# EAGLE design RGBCUBEv1.0-led_board (EAGLE 5.11)
BOM: EXCLUDE; PARTNO: *
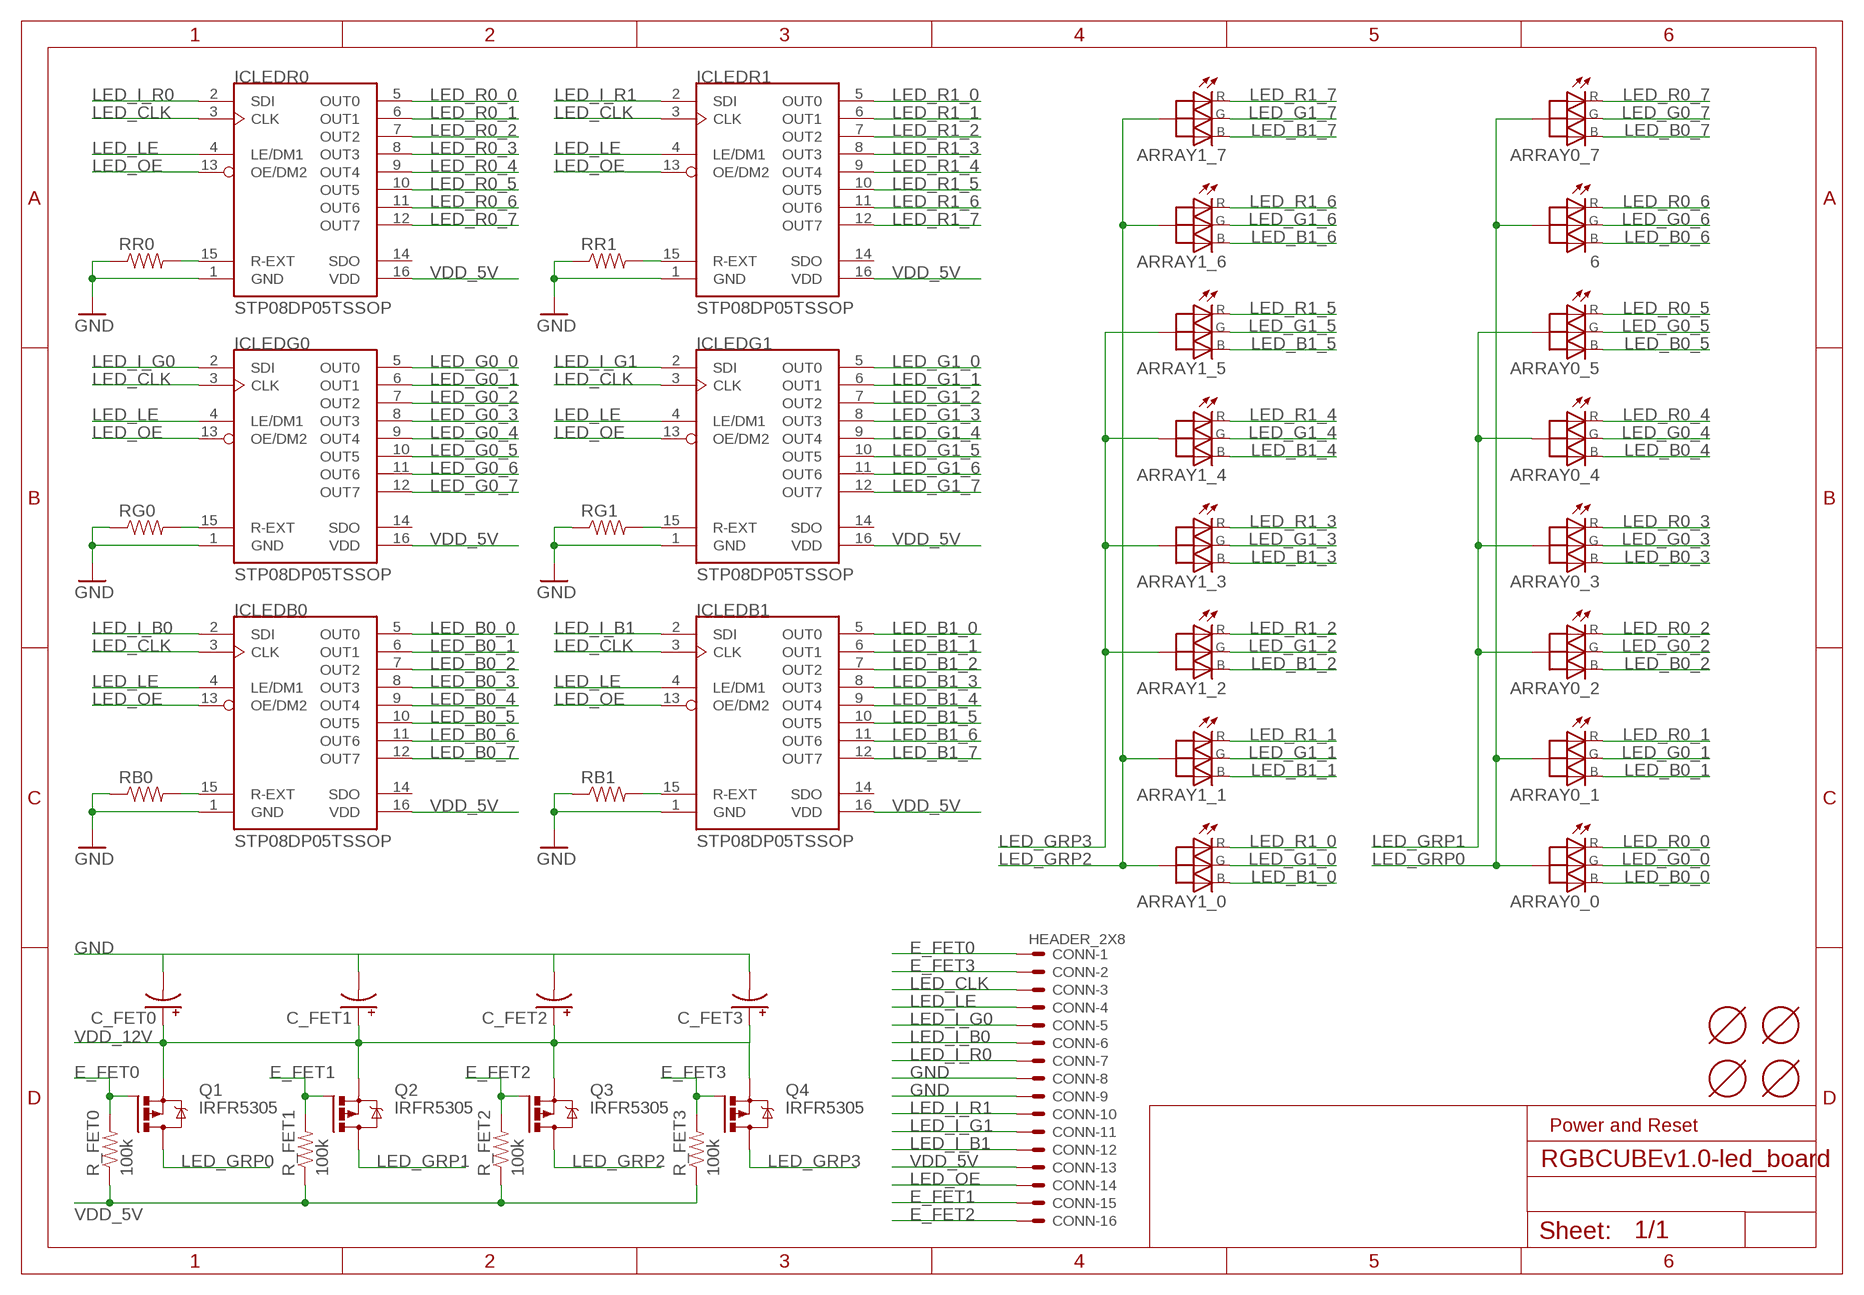
[diagram p0: schematic, sheet 1]

## Parts
6  LED_RGB_5MMRAD  [LED_RGB_5MM_RAD]
ARRAY0_0  LED_RGB_5MMRAD  [LED_RGB_5MM_RAD]
ARRAY0_1  LED_RGB_5MMRAD  [LED_RGB_5MM_RAD]
ARRAY0_2  LED_RGB_5MMRAD  [LED_RGB_5MM_RAD]
ARRAY0_3  LED_RGB_5MMRAD  [LED_RGB_5MM_RAD]
ARRAY0_4  LED_RGB_5MMRAD  [LED_RGB_5MM_RAD]
ARRAY0_5  LED_RGB_5MMRAD  [LED_RGB_5MM_RAD]
ARRAY0_7  LED_RGB_5MMRAD  [LED_RGB_5MM_RAD]
ARRAY1_0  LED_RGB_5MMRAD  [LED_RGB_5MM_RAD]
ARRAY1_1  LED_RGB_5MMRAD  [LED_RGB_5MM_RAD]
ARRAY1_2  LED_RGB_5MMRAD  [LED_RGB_5MM_RAD]
ARRAY1_3  LED_RGB_5MMRAD  [LED_RGB_5MM_RAD]
ARRAY1_4  LED_RGB_5MMRAD  [LED_RGB_5MM_RAD]
ARRAY1_5  LED_RGB_5MMRAD  [LED_RGB_5MM_RAD]
ARRAY1_6  LED_RGB_5MMRAD  [LED_RGB_5MM_RAD]
ARRAY1_7  LED_RGB_5MMRAD  [LED_RGB_5MM_RAD]
C_FET0  CAP_POL7343  [EIA7343]
C_FET1  CAP_POL7343  [EIA7343]
C_FET2  CAP_POL7343  [EIA7343]
C_FET3  CAP_POL7343  [EIA7343]
CONN  HEADER_2X8  [HEADER_2MM_2X8]
ICLEDB0  STP08DP05TSSOP  [TSSOP-16]
ICLEDB1  STP08DP05TSSOP  [TSSOP-16]
ICLEDG0  STP08DP05TSSOP  [TSSOP-16]
ICLEDG1  STP08DP05TSSOP  [TSSOP-16]
ICLEDR0  STP08DP05TSSOP  [TSSOP-16]
ICLEDR1  STP08DP05TSSOP  [TSSOP-16]
Q1  IRFR5305  [D-PAK_TO252AA]
Q2  IRFR5305  [D-PAK_TO252AA]
Q3  IRFR5305  [D-PAK_TO252AA]
Q4  IRFR5305  [D-PAK_TO252AA]
R_FET0  100k  RESISTOR0402-RES  [0402-RES]
R_FET1  100k  RESISTOR0402-RES  [0402-RES]
R_FET2  100k  RESISTOR0402-RES  [0402-RES]
R_FET3  100k  RESISTOR0402-RES  [0402-RES]
RB0  RESISTOR0402-RES  [0402-RES]
RB1  RESISTOR0402-RES  [0402-RES]
RG0  RESISTOR0402-RES  [0402-RES]
RG1  RESISTOR0402-RES  [0402-RES]
RR0  RESISTOR0402-RES  [0402-RES]
RR1  RESISTOR0402-RES  [0402-RES]
U$1  MOUNT-HOLE3.1MM  [MOUNT-HOLE3.1]
U$2  MOUNT-HOLE3.1MM  [MOUNT-HOLE3.1]
U$3  MOUNT-HOLE3.1MM  [MOUNT-HOLE3.1]
U$4  MOUNT-HOLE3.1MM  [MOUNT-HOLE3.1]

## Nets
E_FET0: CONN.1 Q1.1(G) R_FET0.2
E_FET1: CONN.15 Q2.1(G) R_FET1.2
E_FET2: CONN.16 Q3.1(G) R_FET2.2
E_FET3: CONN.2 Q4.1(G) R_FET3.2
GND [power]: C_FET0.C(-) C_FET1.C(-) C_FET2.C(-) C_FET3.C(-) CONN.8 CONN.9 ICLEDB0.1(GND) ICLEDB1.1(GND) ICLEDG0.1(GND) ICLEDG1.1(GND) ICLEDR0.1(GND) ICLEDR1.1(GND) RB0.1 RB1.1 RG0.1 RG1.1 RR0.1 RR1.1
LED_B0_0: ARRAY0_0.B ICLEDB0.5(OUT0)
LED_B0_1: ARRAY0_1.B ICLEDB0.6(OUT1)
LED_B0_2: ARRAY0_2.B ICLEDB0.7(OUT2)
LED_B0_3: ARRAY0_3.B ICLEDB0.8(OUT3)
LED_B0_4: ARRAY0_4.B ICLEDB0.9(OUT4)
LED_B0_5: ARRAY0_5.B ICLEDB0.10(OUT5)
LED_B0_6: 6.B ICLEDB0.11(OUT6)
LED_B0_7: ARRAY0_7.B ICLEDB0.12(OUT7)
LED_B1_0: ARRAY1_0.B ICLEDB1.5(OUT0)
LED_B1_1: ARRAY1_1.B ICLEDB1.6(OUT1)
LED_B1_2: ARRAY1_2.B ICLEDB1.7(OUT2)
LED_B1_3: ARRAY1_3.B ICLEDB1.8(OUT3)
LED_B1_4: ARRAY1_4.B ICLEDB1.9(OUT4)
LED_B1_5: ARRAY1_5.B ICLEDB1.10(OUT5)
LED_B1_6: ARRAY1_6.B ICLEDB1.11(OUT6)
LED_B1_7: ARRAY1_7.B ICLEDB1.12(OUT7)
LED_CLK: CONN.3 ICLEDB0.3(CLK) ICLEDB1.3(CLK) ICLEDG0.3(CLK) ICLEDG1.3(CLK) ICLEDR0.3(CLK) ICLEDR1.3(CLK)
LED_G0_0: ARRAY0_0.G ICLEDG0.5(OUT0)
LED_G0_1: ARRAY0_1.G ICLEDG0.6(OUT1)
LED_G0_2: ARRAY0_2.G ICLEDG0.7(OUT2)
LED_G0_3: ARRAY0_3.G ICLEDG0.8(OUT3)
LED_G0_4: ARRAY0_4.G ICLEDG0.9(OUT4)
LED_G0_5: ARRAY0_5.G ICLEDG0.10(OUT5)
LED_G0_6: 6.G ICLEDG0.11(OUT6)
LED_G0_7: ARRAY0_7.G ICLEDG0.12(OUT7)
LED_G1_0: ARRAY1_0.G ICLEDG1.5(OUT0)
LED_G1_1: ARRAY1_1.G ICLEDG1.6(OUT1)
LED_G1_2: ARRAY1_2.G ICLEDG1.7(OUT2)
LED_G1_3: ARRAY1_3.G ICLEDG1.8(OUT3)
LED_G1_4: ARRAY1_4.G ICLEDG1.9(OUT4)
LED_G1_5: ARRAY1_5.G ICLEDG1.10(OUT5)
LED_G1_6: ARRAY1_6.G ICLEDG1.11(OUT6)
LED_G1_7: ARRAY1_7.G ICLEDG1.12(OUT7)
LED_GRP0: 6.A ARRAY0_0.A ARRAY0_1.A ARRAY0_7.A Q1.4(D)
LED_GRP1: ARRAY0_2.A ARRAY0_3.A ARRAY0_4.A ARRAY0_5.A Q2.4(D)
LED_GRP2: ARRAY1_0.A ARRAY1_1.A ARRAY1_6.A ARRAY1_7.A Q3.4(D)
LED_GRP3: ARRAY1_2.A ARRAY1_3.A ARRAY1_4.A ARRAY1_5.A Q4.4(D)
LED_I_B0: CONN.6 ICLEDB0.2(SDI)
LED_I_B1: CONN.12 ICLEDB1.2(SDI)
LED_I_G0: CONN.5 ICLEDG0.2(SDI)
LED_I_G1: CONN.11 ICLEDG1.2(SDI)
LED_I_R0: CONN.7 ICLEDR0.2(SDI)
LED_I_R1: CONN.10 ICLEDR1.2(SDI)
LED_LE: CONN.4 ICLEDB0.4(LE/DM1) ICLEDB1.4(LE/DM1) ICLEDG0.4(LE/DM1) ICLEDG1.4(LE/DM1) ICLEDR0.4(LE/DM1) ICLEDR1.4(LE/DM1)
LED_OE: CONN.14 ICLEDB0.13(OE/DM2) ICLEDB1.13(OE/DM2) ICLEDG0.13(OE/DM2) ICLEDG1.13(OE/DM2) ICLEDR0.13(OE/DM2) ICLEDR1.13(OE/DM2)
LED_R0_0: ARRAY0_0.R ICLEDR0.5(OUT0)
LED_R0_1: ARRAY0_1.R ICLEDR0.6(OUT1)
LED_R0_2: ARRAY0_2.R ICLEDR0.7(OUT2)
LED_R0_3: ARRAY0_3.R ICLEDR0.8(OUT3)
LED_R0_4: ARRAY0_4.R ICLEDR0.9(OUT4)
LED_R0_5: ARRAY0_5.R ICLEDR0.10(OUT5)
LED_R0_6: 6.R ICLEDR0.11(OUT6)
LED_R0_7: ARRAY0_7.R ICLEDR0.12(OUT7)
LED_R1_0: ARRAY1_0.R ICLEDR1.5(OUT0)
LED_R1_1: ARRAY1_1.R ICLEDR1.6(OUT1)
LED_R1_2: ARRAY1_2.R ICLEDR1.7(OUT2)
LED_R1_3: ARRAY1_3.R ICLEDR1.8(OUT3)
LED_R1_4: ARRAY1_4.R ICLEDR1.9(OUT4)
LED_R1_5: ARRAY1_5.R ICLEDR1.10(OUT5)
LED_R1_6: ARRAY1_6.R ICLEDR1.11(OUT6)
LED_R1_7: ARRAY1_7.R ICLEDR1.12(OUT7)
RB0: ICLEDB0.15(R-EXT) RB0.2
RB1: ICLEDB1.15(R-EXT) RB1.2
RG0: ICLEDG0.15(R-EXT) RG0.2
RG1: ICLEDG1.15(R-EXT) RG1.2
RR0 [power]: ICLEDR0.15(R-EXT) RR0.2
RR1 [power]: ICLEDR1.15(R-EXT) RR1.2
VDD_5V [power]: CONN.13 ICLEDB0.16(VDD) ICLEDB1.16(VDD) ICLEDG0.16(VDD) ICLEDG1.16(VDD) ICLEDR0.16(VDD) ICLEDR1.16(VDD) R_FET0.1 R_FET1.1 R_FET2.1 R_FET3.1
VDD_12V: C_FET0.A(+) C_FET1.A(+) C_FET2.A(+) C_FET3.A(+) Q1.3(S) Q2.3(S) Q3.3(S) Q4.3(S)
Unconnected: ICLEDB0.14(SDO) ICLEDB1.14(SDO) ICLEDG0.14(SDO) ICLEDG1.14(SDO) ICLEDR0.14(SDO) ICLEDR1.14(SDO)

## Notes on the sheet
- Power and Reset

## Library data of the parts
6 ARRAY0_0 ARRAY0_1-ARRAY0_5 ARRAY0_7 ARRAY1_0 ARRAY1_1-ARRAY1_7 = rgb_cube:LED_RGB_5MM
C_FET0 C_FET1-C_FET3 = rgb_cube:CAP_POL: Capacitor Polarized These are standard SMD and PTH capacitors. Normally 10uF, 47uF, and 100uF in electrolytic and tantalum varieties. Always verify the external diameter of the through hole cap, it varies with capacity, voltage, and manufacturer. The EIA devices should be standard.
CONN = rgb_cube:HEADER_2X8
ICLEDB0 ICLEDB1 ICLEDG0 ICLEDG1 ICLEDR0 ICLEDR1 = rgb_cube:STP08DP05
Q1-Q4 = transistor-power:IRF?5305: HEXFET Power MOSFET Source: http://www.irf.com/product-info/datasheets/data/irfr5305pbf.pdf
R_FET0 R_FET1-R_FET3 RB0 RB1 RG0 RG1 RR0 RR1 = rgb_cube:RESISTOR: Resistor Basic schematic elements and footprints for 0603, 1206, and PTH 1/10th watt (small) resistors.
U$1-U$4 = pixhawk2:MOUNT-HOLE

## Net classes
0 signal: width 0.203 mm, drill 0.3 mm, clearance 0.203 mm
1 power: width 0.254 mm, drill 0.3 mm, clearance 0.203 mm

## Board
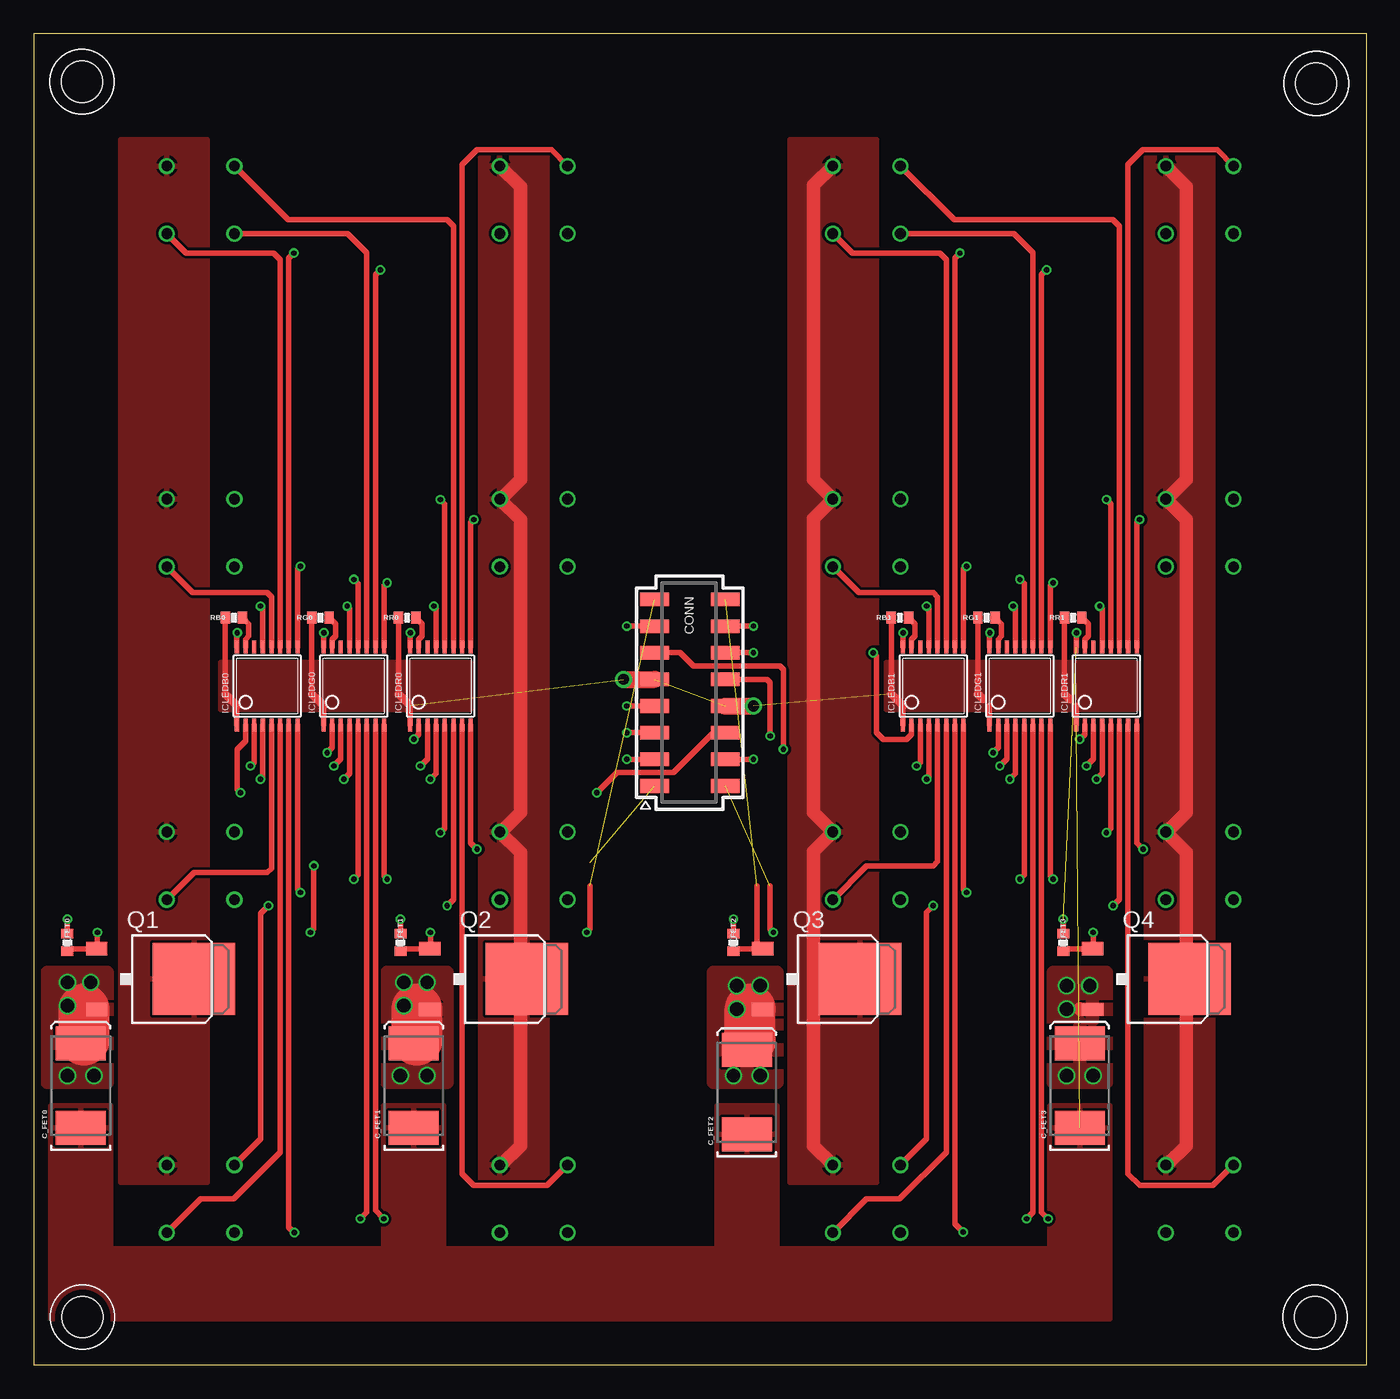
[diagram p1: board, top side]
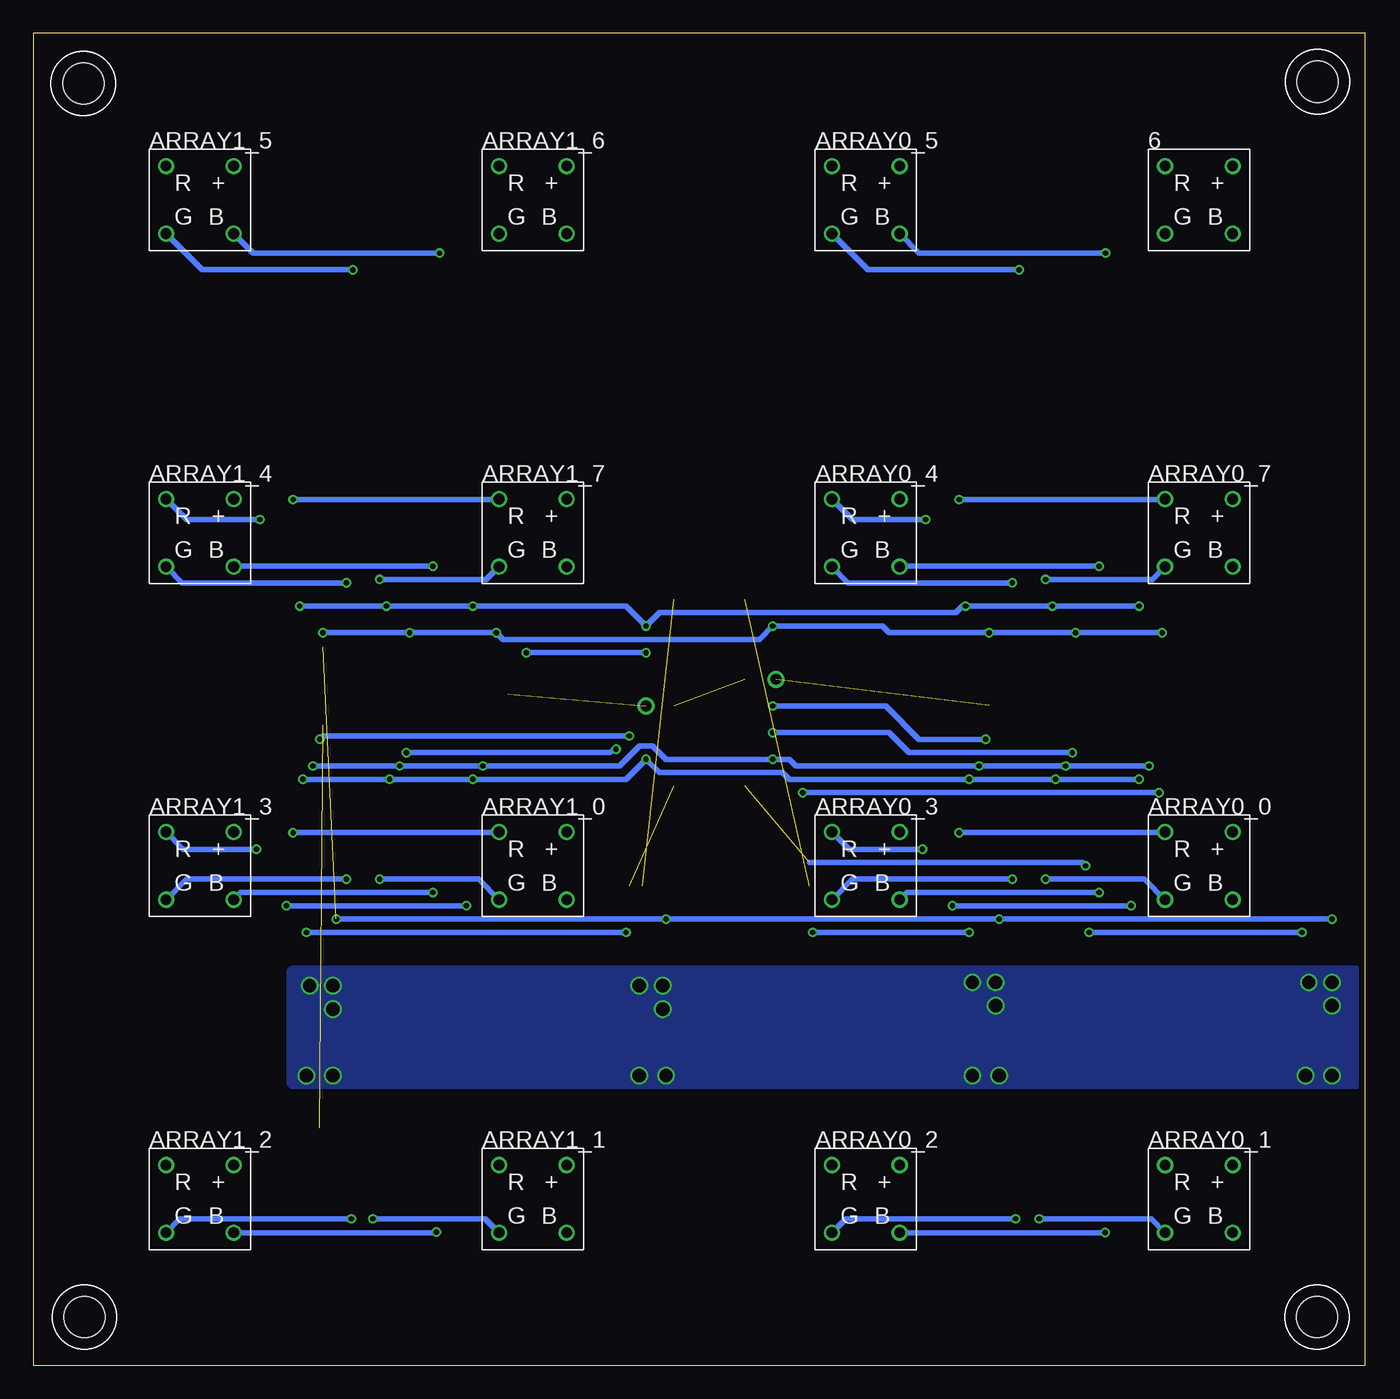
[diagram p2: board, bottom side, seen from below]

Size 100 x 100 mm. Coordinates in mm from the lower left corner, seen from the top.
Outline: 0,0 0,100 100,100 100,0 0,0
Copper layers (1*16): Top 0.035mm / dielectric 1.5mm / Bottom 0.035mm
Design rules "multi-cb_035um-cu *": minimum track width 6mil, minimum drill 12mil, track to track 6mil, track to pad 6mil, pad to pad 6mil, via to via 6mil, smd to smd 6mil, copper to edge 20mil, drill to drill 8mil, minimum pad ring 8mil, minimum via ring 6mil, stop-mask expansion 3mil, vias tented up to drill 0mil, thermal gap 8mil

### Footprints (pad centres in the part's own frame; a part is rotated, then mirrored left to right if it is on the bottom)
LED_RGB_5MM_RAD = drill 0.8 round: A 2.54,2.54; B 2.54,-2.54; G -2.54,-2.54; R -2.54,2.54
EIA7343 = smd 2.55 x 3.75: A 3.17,0; C -3.17,0
HEADER_2MM_2X8 = smd 1.02 x 2.16: 1 7,-2.925; 2 7,2.385; 3 5,-2.925; 4 5,2.385; 5 3,-2.925; 6 3,2.385; 7 1,-2.925; 8 1,2.385; 9 -1,-2.925; 10 -1,2.385; 11 -3,-2.925; 12 -3,2.385; 13 -5,-2.925; 14 -5,2.385; 15 -7,-2.925; 16 -7,2.385
TSSOP-16 = smd 0.305 x 0.991: 1 -2.275,-2.918; 2 -1.625,-2.918; 3 -0.975,-2.918; 4 -0.325,-2.918; 5 0.325,-2.918; 6 0.975,-2.918; 7 1.625,-2.918; 8 2.275,-2.918; 9 2.275,2.918; 10 1.625,2.918; 11 0.975,2.918; 12 0.325,2.918; 13 -0.325,2.918; 14 -0.975,2.918; 15 -1.625,2.918; 16 -2.275,2.918
D-PAK_TO252AA = smd 1 x 1.6: 1 -2.28,-4.8; 3 2.28,-4.8 | smd 5.4 x 6.2: 4 0,2.5
0402-RES = smd 0.7 x 0.9: 1 -0.65,0; 2 0.65,0
MOUNT-HOLE3.1 = hole 3.1: 0,0

### Placement (x,y rotation side)
6  12.5,87.5 0 bottom
ARRAY0_0  12.5,37.5 0 bottom
ARRAY0_1  12.5,12.5 0 bottom
ARRAY0_2  37.5,12.5 0 bottom
ARRAY0_3  37.5,37.5 0 bottom
ARRAY0_4  37.5,62.5 0 bottom
ARRAY0_5  37.5,87.5 0 bottom
ARRAY0_7  12.5,62.5 0 bottom
ARRAY1_0  62.5,37.5 0 bottom
ARRAY1_1  62.5,12.5 0 bottom
ARRAY1_2  87.5,12.5 0 bottom
ARRAY1_3  87.5,37.5 0 bottom
ARRAY1_4  87.5,62.5 0 bottom
ARRAY1_5  87.5,87.5 0 bottom
ARRAY1_6  62.5,87.5 0 bottom
ARRAY1_7  62.5,62.5 0 bottom
C_FET0  3.5,21 90 top
C_FET1  28.5,21 90 top
C_FET2  53.5,20.5 90 top
C_FET3  78.5,21 90 top
CONN  49.5,50.5 270 top
ICLEDB0  17.5,51 0 top
ICLEDB1  67.5,51 0 top
ICLEDG0  24,51 0 top
ICLEDG1  74,51 0 top
ICLEDR0  30.5,51 0 top
ICLEDR1  80.5,51 0 top
Q1  9.5,29 270 top
Q2  34.5,29 270 top
Q3  59.5,29 270 top
Q4  84.25,29 270 top
R_FET0  2.5,31.75 270 top
R_FET1  27.5,31.75 270 top
R_FET2  52.5,31.75 270 top
R_FET3  77.25,31.75 270 top
RB0  15,56.12 0 top
RB1  65,56.12 0 top
RG0  21.5,56.12 0 top
RG1  71.5,56.12 0 top
RR0  28,56.12 0 top
RR1  78,56.12 0 top
U$1  96.17,3.62 0 top
U$2  3.64,3.62 0 top
U$3  3.6,96.36 0 top
U$4  96.25,96.23 0 top

### Tracks (layer width: path | path; a pad name or v marks a point on that pad's centre or on a via)
E_FET0  (via drill 0.4)  (1 unrouted)
  Top 0.406: R_FET0.2 2.68,31.28 Q1.1 4.75,31.33 v4.75,32.5 | v20.75,32.5 21,32.75 v21,37.5
  Bottom 0.406: v4.75,32.5 v20.75,32.5 | v21,37.5 21.25,37.75 41.75,37.75
E_FET1  (via drill 0.4)  (1 unrouted)
  Top 0.406: R_FET1.2 27.68,31.28 Q2.1 29.75,31.33 v29.75,32.5 | v41.5,32.5 41.75,32.75 41.75,36
  Bottom 0.406: v29.75,32.5 v41.5,32.5
E_FET2  (1 unrouted)
  Top 0.406: R_FET2.2 52.68,31.28 | 52.68,31.28 Q3.1 | 52.68,31.28 52.71,31.25 54.5,31.25 54.25,31.5 54.25,36
E_FET3  (via drill 0.4)  (1 unrouted)
  Top 0.406: Q4.1 77.43,31.28 R_FET3.2 77.4,31.25 79.5,31.25 v79.5,32.5 | v55.5,32.5 55.25,32.75 55.25,36
  Bottom 0.406: v55.5,32.5 v79.5,32.5
GND  (via drill 0.8 pad 1.27)  (4 unrouted)
  Top 0.406: ICLEDR0.1 28.23,49.52 | ICLEDG0.1 21.73,49.52 | ICLEDB0.1 15.22,49.52 | 20.85,50.4 RG0.1 | 27.35,50.4 RR0.1 | 14.35,50.4 RB0.1 | ICLEDR1.1 78.22,49.52 | ICLEDG1.1 71.72,49.52 | ICLEDB1.1 65.22,49.52 | 70.85,50.4 RG1.1 | 77.35,50.4 RR1.1 | 64.35,50.4 RB1.1
  Top 0.61: 21.73,49.52 20.85,50.4 | 28.23,49.52 27.35,50.4 | 15.22,49.52 14.35,50.4 | 70.85,50.4 71.25,50 | 77.75,50 77.35,50.4 | 65.22,49.52 64.35,50.4
  Top 1.27: v44.25,51.5 CONN.9 | CONN.8 v54,49.5
  pour Top: 14,52.75 32.75,52.75 32.75,49.25 14,49.25
  pour Top: 64,52.75 82.75,52.75 82.75,49.25 64,49.25
  pour Top: 1.25,19.5 5.75,19.5 5.75,8.75 26.25,8.75 26.25,19.5 30.75,19.5 30.75,8.75 51.25,8.75 51.25,19.5 55.75,19.5 55.75,8.75 76.25,8.75 76.25,19.5 80.75,19.5 80.75,19.25 80.75,3.5 1.25,3.5
LED_B0_0
  Top 0.406: ICLEDB0.5 17.82,37.33 17.5,37 12,37 ARRAY0_0.B
LED_B0_1
  Top 0.406: ICLEDB0.6 18.48,16 14.97,12.5 12.5,12.5 ARRAY0_1.B
LED_B0_2  (via drill 0.4)
  Top 0.406: ICLEDB0.7 19.12,10.38 v19.54,9.96
  Bottom 0.406: v19.54,9.96 ARRAY0_2.B
LED_B0_3  (via drill 0.4)
  Top 0.406: ICLEDB0.8 19.77,35.73 v20,35.5
  Bottom 0.406: v20,35.5 34.42,35.5 ARRAY0_3.B
LED_B0_4  (via drill 0.4)
  Top 0.406: ICLEDB0.9 19.77,59.77 v20,60
  Bottom 0.406: v20,60 34.92,60 ARRAY0_4.B
LED_B0_5  (via drill 0.4)
  Top 0.406: ICLEDB0.10 19.12,83.12 v19.5,83.5
  Bottom 0.406: v19.5,83.5 33.5,83.5 ARRAY0_5.B
LED_B0_6
  Top 0.406: ICLEDB0.11 18.48,83.03 18,83.5 11.42,83.5 6.B
LED_B0_7
  Top 0.406: ICLEDB0.12 17.82,57.67 17.5,58 11.92,58 ARRAY0_7.B
LED_B1_0
  Top 0.406: ICLEDB1.5 67.83,37.83 67.5,37.5 62.5,37.5 ARRAY1_0.B
LED_B1_1
  Top 0.406: ICLEDB1.6 68.47,16 64.97,12.5 62.5,12.5 ARRAY1_1.B
LED_B1_2  (via drill 0.4)
  Top 0.406: ICLEDB1.7 69.12,10.62 v69.75,10
  Bottom 0.406: v69.75,10 69.79,9.96 ARRAY1_2.B
LED_B1_3  (via drill 0.4)
  Top 0.406: ICLEDB1.8 69.78,35.73 v70,35.5
  Bottom 0.406: v70,35.5 84.42,35.5 ARRAY1_3.B
LED_B1_4  (via drill 0.4)
  Top 0.406: ICLEDB1.9 69.78,59.77 v70,60
  Bottom 0.406: v70,60 84.92,60 ARRAY1_4.B
LED_B1_5  (via drill 0.4)
  Top 0.406: ICLEDB1.10 69.12,83.12 v69.5,83.5
  Bottom 0.406: v69.5,83.5 83.5,83.5 ARRAY1_5.B
LED_B1_6
  Top 0.406: ICLEDB1.11 68.47,83.03 68,83.5 61.42,83.5 ARRAY1_6.B
LED_B1_7
  Top 0.406: ICLEDB1.12 67.83,57.67 67.5,58 61.92,58 ARRAY1_7.B
LED_CLK  (via drill 0.4, 0.4 pad 0.61)
  Top 0.406: ICLEDB0.3 16.52,45.27 v16.25,45 | ICLEDR0.3 29.52,45.52 v29,45 | ICLEDG0.3 23.02,45.52 v22.5,45 | ICLEDB1.3 66.53,45.27 v66.25,45 | ICLEDR1.3 79.53,45.52 v79,45 | ICLEDG1.3 73.03,45.52 v72.5,45 | v44.5,45.5 CONN.3
  Bottom 0.406: v16.25,45 v22.5,45 v29,45 42.75,45 43.25,45.5 v44.5,45.5 52.5,45.5 53.5,46.5 54.5,46.5 56,45 v66.25,45 v72.5,45 v79,45
LED_G0_0  (via drill 0.4)
  Top 0.406: ICLEDG0.5 24.32,36.83 v24,36.5
  Bottom 0.406: v24,36.5 16.58,36.5 ARRAY0_0.G
LED_G0_1  (via drill 0.4)
  Top 0.406: ICLEDG0.6 24.98,11.47 v24.5,11
  Bottom 0.406: v24.5,11 16.08,11 ARRAY0_1.G
LED_G0_2  (via drill 0.4)
  Top 0.406: ICLEDG0.7 25.62,11.62 v26.25,11
  Bottom 0.406: v26.25,11 39,11 ARRAY0_2.G
LED_G0_3  (via drill 0.4)
  Top 0.406: ICLEDG0.8 26.27,36.73 v26.5,36.5
  Bottom 0.406: v26.5,36.5 38.5,36.5 ARRAY0_3.G
LED_G0_4  (via drill 0.4)
  Top 0.406: ICLEDG0.9 26.27,58.52 v26.5,58.75
  Bottom 0.406: v26.5,58.75 38.83,58.75 ARRAY0_4.G
LED_G0_5  (via drill 0.4)
  Top 0.406: ICLEDG0.10 25.62,81.88 v26,82.25
  Bottom 0.406: v26,82.25 37.33,82.25 ARRAY0_5.G
LED_G0_6
  Top 0.406: ICLEDG0.11 24.98,83.53 23.54,84.96 6.G
LED_G0_7  (via drill 0.4)
  Top 0.406: ICLEDG0.12 24.32,58.67 v24,59
  Bottom 0.406: v24,59 16,59 ARRAY0_7.G
LED_G1_0  (via drill 0.4)
  Top 0.406: ICLEDG1.5 74.33,36.83 v74,36.5
  Bottom 0.406: v74,36.5 66.58,36.5 ARRAY1_0.G
LED_G1_1  (via drill 0.4)
  Top 0.406: ICLEDG1.6 74.97,11.47 v74.5,11
  Bottom 0.406: v74.5,11 66.08,11 ARRAY1_1.G
LED_G1_2  (via drill 0.4)
  Top 0.406: ICLEDG1.7 75.62,11.5 v76.12,11
  Bottom 0.406: v76.12,11 89,11 ARRAY1_2.G
LED_G1_3  (via drill 0.4)
  Top 0.406: ICLEDG1.8 76.28,36.73 v76.5,36.5
  Bottom 0.406: v76.5,36.5 88.5,36.5 ARRAY1_3.G
LED_G1_4  (via drill 0.4)
  Top 0.406: ICLEDG1.9 76.28,58.52 v76.5,58.75
  Bottom 0.406: v76.5,58.75 88.83,58.75 ARRAY1_4.G
LED_G1_5  (via drill 0.4)
  Top 0.406: ICLEDG1.10 75.62,81.88 v76,82.25
  Bottom 0.406: v76,82.25 87.33,82.25 ARRAY1_5.G
LED_G1_6
  Top 0.406: ICLEDG1.11 74.97,83.53 73.54,84.96 ARRAY1_6.G
LED_G1_7  (via drill 0.4)
  Top 0.406: ICLEDG1.12 74.33,58.67 v74,59
  Bottom 0.406: v74,59 66,59 ARRAY1_7.G
LED_GRP0
  pour Top: 6.5,92 13,92 13,13.75 6.5,13.75
LED_GRP1
  Top 1.016: ARRAY0_5.A 36.5,88.5 36.5,66.5 35.04,65.04 ARRAY0_4.A 36.5,63.5 36.5,41.5 35.04,40.04 ARRAY0_3.A 36.5,38.5 36.5,16.5 35.04,15.04 ARRAY0_2.A
  pour Top: 33.5,92 38.5,92 38.5,13.75 33.5,13.75
LED_GRP2
  Top 1.016: ARRAY1_6.A 58.5,88.58 58.5,66.5 ARRAY1_7.A 58.5,63.58 58.5,41.5 ARRAY1_0.A 58.5,38.58 58.5,16.5 ARRAY1_1.A
  pour Top: 56.75,92 63.25,92 63.25,13.75 56.75,13.75
LED_GRP3
  Top 1.016: ARRAY1_5.A 86.5,88.5 86.5,66.5 85.04,65.04 ARRAY1_4.A 86.5,63.5 86.5,41.5 85.04,40.04 ARRAY1_3.A 86.5,38.5 86.5,16.5 85.04,15.04 ARRAY1_2.A
  pour Top: 83.5,92 88.5,92 88.5,13.75 83.5,13.75
LED_I_B0  (via drill 0.4)
  Top 0.406: v42.25,43 43.75,44.5 48,44.5 51,47.5 CONN.6 | ICLEDB0.2 15.88,46.88 15.25,46.25 15.25,43.25 v15.5,43
  Bottom 0.406: v15.5,43 v42.25,43
LED_I_B1  (via drill 0.4, 0.4 pad 0.61)
  Top 0.406: CONN.12 v54,53.5 | v63,53.5 63.25,53.25 63.25,47.5 63.75,47 65.5,47 65.88,47.38 ICLEDB1.2
  Bottom 0.406: v54,53.5 v63,53.5
LED_I_G0  (via drill 0.4)
  Top 0.406: ICLEDG0.2 22.38,46.38 v22,46 | v44.5,47.5 CONN.5
  Bottom 0.406: v22,46 34.25,46 35.75,47.5 v44.5,47.5
LED_I_G1  (via drill 0.4 pad 0.41)
  Top 0.406: CONN.11 48.5,53.5 49.5,52.5 56,52.5 56.25,52.25 v56.25,46.25 | ICLEDG1.2 72.38,46.38 v72,46
  Bottom 0.406: v72,46 56.75,46 v56.25,46.25
LED_I_R0  (via drill 0.4)
  Top 0.406: ICLEDR0.2 28.88,47.38 v28.5,47 | v44.5,49.5 CONN.7
  Bottom 0.406: v28.5,47 33.5,47 36,49.5 v44.5,49.5
LED_I_R1  (via drill 0.4, 0.4 pad 0.61)
  Top 0.406: CONN.10 55,51.5 55.25,51.25 v55.25,47.25 | ICLEDR1.2 78.88,47.38 v78.5,47
  Bottom 0.406: v55.25,47.25 78.25,47.25 v78.5,47
LED_LE  (via drill 0.4)
  Top 0.406: v54,45.5 CONN.4 | v17,44 17.18,44.17 ICLEDB0.4 | ICLEDG0.4 23.68,44.42 v23.25,44 | ICLEDR0.4 30.18,44.42 v29.75,44 | v67,44 67.17,44.17 ICLEDB1.4 | ICLEDG1.4 73.67,44.42 v73.25,44 | ICLEDR1.4 80.17,44.42 v79.75,44
  Bottom 0.406: v17,44 v23.25,44 v29.75,44 43.25,44 43.75,44.5 53,44.5 v54,45.5 55.5,44 v67,44 v73.25,44 v79.75,44
LED_OE  (via drill 0.4)
  Top 0.406: v54,55.5 CONN.14 | ICLEDB0.13 17.18,56.83 v17,57 | v23.5,57 23.68,56.83 ICLEDG0.13 | ICLEDR0.13 30.18,56.83 v30,57 | ICLEDB1.13 67.17,56.83 v67,57 | v73.5,57 73.67,56.83 ICLEDG1.13 | ICLEDR1.13 80.17,56.83 v80,57
  Bottom 0.406: v17,57 v23.5,57 v30,57 30.25,57 30.75,56.5 53,56.5 v54,55.5 55.5,57 v67,57 v73.5,57 v80,57
LED_R0_0  (via drill 0.4)
  Top 0.406: ICLEDR0.5 30.82,40.33 v30.5,40
  Bottom 0.406: v30.5,40 15.08,40 ARRAY0_0.R
LED_R0_1  (via drill 0.4)
  Top 0.406: ICLEDR0.6 31.48,34.98 v31,34.5 | v17.58,34.5 17,33.92 17,17 ARRAY0_1.R
  Bottom 0.406: v17.58,34.5 v31,34.5
LED_R0_2
  Top 0.406: ICLEDR0.7 32.12,14.38 33,13.5 38.5,13.5 ARRAY0_2.R
LED_R0_3  (via drill 0.4)
  Top 0.406: ICLEDR0.8 32.77,39.23 v33.25,38.75
  Bottom 0.406: v33.25,38.75 38.75,38.75 ARRAY0_3.R
LED_R0_4  (via drill 0.4)
  Top 0.406: ICLEDR0.9 32.77,63.27 v33,63.5
  Bottom 0.406: v33,63.5 38.5,63.5 ARRAY0_4.R
LED_R0_5
  Top 0.406: ICLEDR0.10 32.12,90.12 33.25,91.25 38.83,91.25 ARRAY0_5.R
LED_R0_6
  Top 0.406: ICLEDR0.11 31.48,85.53 31,86 19.08,86 6.R
LED_R0_7  (via drill 0.4)
  Top 0.406: ICLEDR0.12 30.82,64.67 v30.5,65
  Bottom 0.406: v30.5,65 15.08,65 ARRAY0_7.R
LED_R1_0  (via drill 0.4)
  Top 0.406: ICLEDR1.5 80.83,40.33 v80.5,40
  Bottom 0.406: v80.5,40 65.08,40 ARRAY1_0.R
LED_R1_1  (via drill 0.4)
  Top 0.406: ICLEDR1.6 81.47,34.98 v81,34.5 | ARRAY1_1.R 67,17 67,34 v67.5,34.5
  Bottom 0.406: v67.5,34.5 v81,34.5
LED_R1_2
  Top 0.406: ICLEDR1.7 82.12,14.38 83,13.5 88.5,13.5 ARRAY1_2.R
LED_R1_3  (via drill 0.4)
  Top 0.406: ICLEDR1.8 82.78,39.23 v83.25,38.75
  Bottom 0.406: v83.25,38.75 88.75,38.75 ARRAY1_3.R
LED_R1_4  (via drill 0.4)
  Top 0.406: ICLEDR1.9 82.78,63.27 v83,63.5
  Bottom 0.406: v83,63.5 88.5,63.5 ARRAY1_4.R
LED_R1_5
  Top 0.406: ICLEDR1.10 82.12,90.12 83.25,91.25 88.83,91.25 ARRAY1_5.R
LED_R1_6
  Top 0.406: ICLEDR1.11 81.47,85.53 81,86 69.08,86 ARRAY1_6.R
LED_R1_7  (via drill 0.4)
  Top 0.406: ICLEDR1.12 80.83,64.67 v80.5,65
  Bottom 0.406: v80.5,65 65.08,65 ARRAY1_7.R
RB0
  Top 0.406: ICLEDB0.15 15.88,54.5 16.12,54.75 16.12,55.65 RB0.2
RB1
  Top 0.406: ICLEDB1.15 65.88,54.5 66.12,54.75 66.12,55.65 RB1.2
RG0
  Top 0.406: ICLEDG0.15 22.38,54.5 22.62,54.75 22.62,55.65 RG0.2
RG1
  Top 0.406: ICLEDG1.15 72.38,54.5 72.62,54.75 72.62,55.65 RG1.2
RR0
  Top 0.406: ICLEDR0.15 28.88,54.5 29.12,54.75 29.12,55.65 RR0.2
RR1
  Top 0.406: ICLEDR1.15 78.88,54.5 79.12,54.75 79.12,55.65 RR1.2
VDD_5V  (via drill 0.4, 0.4 pad 0.61)  (1 unrouted)
  Top 0.406: ICLEDB0.16 15.22,55.02 v15.25,55 | v21.75,55 21.73,55.02 ICLEDG0.16 | v28.25,55 28.23,55.02 ICLEDR0.16 | ICLEDB1.16 65.22,55.02 v65.25,55 | v71.75,55 71.72,55.02 ICLEDG1.16 | v78.25,55 78.22,55.02 ICLEDR1.16 | v44.5,55.5 CONN.13 | v52.5,33.5 R_FET2.1 | v27.5,33.5 R_FET1.1 | R_FET0.1 v2.5,33.5 | v77.25,33.5 R_FET3.1
  Bottom 0.406: v15.25,55 v21.75,55 v28.25,55 35.75,55 36.25,55.5 v44.5,55.5 45.5,54.5 64.75,54.5 v65.25,55 v71.75,55 v78.25,55 | v2.5,33.5 v27.5,33.5 v52.5,33.5 v77.25,33.5
VDD_12V  (via drill 1)
  Top 1.016: 3.75,26.75 3.78,26.72 Q1.3 | 28.75,26.75 28.78,26.72 Q2.3 | 53.75,26.75 53.78,26.72 Q3.3 | 78.5,26.75 78.53,26.72 Q4.3
  Top 3.81: 53.75,24.42 53.75,26.75 | 28.75,24.42 28.75,26.75 | 3.75,24.42 3.75,26.75
  other vias: 52.75,28.5 52.75,26.75 54.5,28.5 77.5,28.5 79.25,28.5 77.5,26.75 29.5,28.75 27.75,28.75 27.75,27 4.25,28.75 2.5,28.75 2.5,27 52.5,21.75 54.5,21.75 77.5,21.75 79.5,21.75 29.5,21.75 27.5,21.75 4.5,21.75 2.5,21.75
  pour Bottom: 80.5,29.5 0.75,29.5 0.75,21.25 80.5,21.25
  pour Top: 76.5,29.5 76.5,21.25 80.5,21.25 80.5,29.5
  pour Top: 51,29.5 51,21.25 55.75,21.25 55.75,29.5
  pour Top: 26.5,29.5 31,29.5 31,21.25 26.5,21.25
  pour Top: 1,29.5 5.5,29.5 5.5,21.25 1,21.25